# Altium project ai_uwb_smart_flashlight.PrjPcb (part 6 of 6)
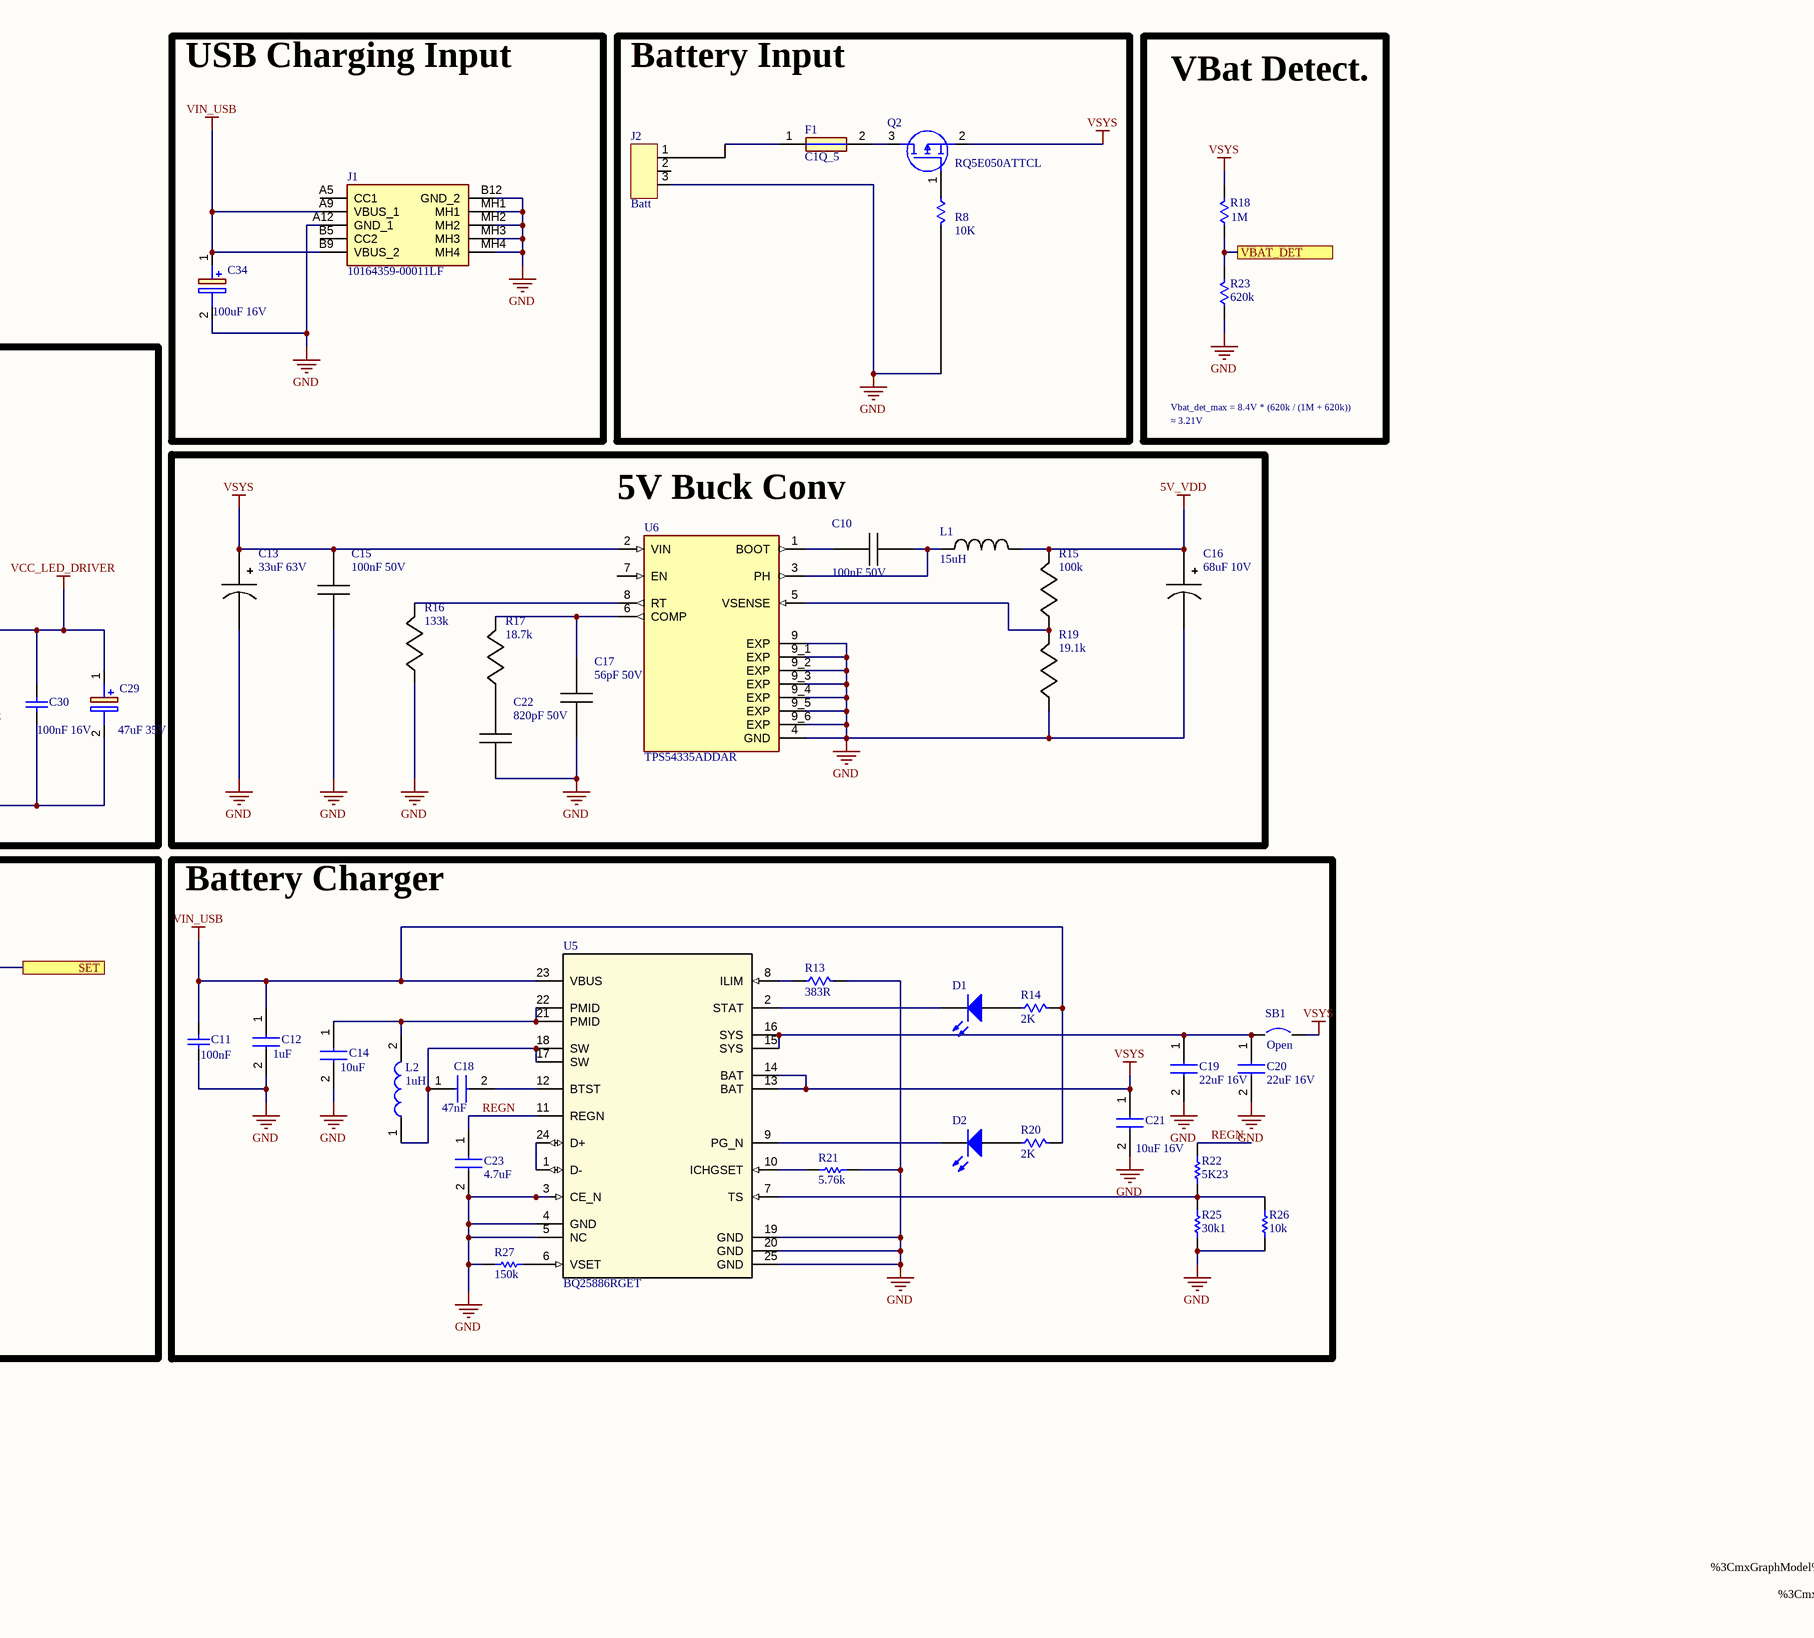
[diagram p8: Power supply.SchDoc, right]

## Sheet Power supply.SchDoc (continued)

### Library data of the parts
C10 C15 = C0805C104M5RACTU: Cap: 1.0E-7; ESR: 0.064; IRMS: 1.64; VDC: 50.0; Vendor: Kemet; Type: DEV; REFDES_2: RefDes; TYPE_2: TYPE; VALUE_2: Value; Manufacturer Part Number: C0805C104M5RACTU; Manufacturer_Name: Kemet; Copyright: Copyright (C) 2018 Accelerated Designs. All rights reserved; RefDes: RefDes; Value: Value
C11 C26 C28 C30 = CC0603KRX7R7BB104: CAP CER 0.1UF 16V X7R 0603; Manufacturer: Yageo; Tolerance: 10%; Material: Ceramic; Insulation Resistance: 100GR; ComponentLink1Description: https://datasheet.ciiva.com/11786/0900766b80d84f1d-11786077.pdf?src-supplier=RSComponents; ComponentLink1URL: https://datasheet.ciiva.com/11786/0900766b80d84f1d-11786077.pdf?src-supplier=RSComponents; Supplier 1: Digi-Key; Manufacturer Part Number: CC0603KRX7R7BB104; RoHS: Yes; Category: Ceramic Capacitors; Stock 1: 17560067; Pricing 1: 1=0,10000, 10=0,04800, 50=0,02600, 100=0,02120, 500=0,01516, 1000=0,01192 (USD); Mount: Surface Mount; Case/Package: 0603; Number of Pins: 2; Case Code (Metric): 1608; Case Code (Imperial): 0603; Min Operating Temperature: -55°C; Max Operating Temperature: 125°C; Capacitance: 100nF; Voltage Rating: 16V; Voltage Rating (DC): 16V; Packaging: Tape and Reel; Package Quantity: 1; Dielectric: X7R; Termination: SMD/SMT; Resistor Type: Ceramic; Voltage: 16V; Series: CC; Length: 1.6mm; Width: 0.031inch; Height: 0.8mm; Thickness: 0.035inch; Depth: 0.8mm; Radiation Hardening: No; REACH SVHC: No SVHC; Lead Free: Lead Free; Halogen Free: Halogen Free; RoHS Compliant: Yes; ComponentLink2URL: https://datasheet.ciiva.com/8033/70765-8033799.pdf?src-supplier=Element14; ComponentLink2Description: https://datasheet.ciiva.com/8033/70765-8033799.pdf?src-supplier=Element14; ComponentLink3URL: https://datasheet.ciiva.com/7978/1489800-7978141.pdf?src-supplier=Element14; ComponentLink3Description: https://datasheet.ciiva.com/7978/1489800-7978141.pdf?src-supplier=Element14; ComponentLink4URL: https://datasheet.ciiva.com/28450/1489800-28450552.pdf?src-supplier=Element14; ComponentLink4Description: https://datasheet.ciiva.com/28450/1489800-28450552.pdf?src-supplier=Element14; ComponentLink5URL: https://datasheet.ciiva.com/46430/1734573-46430156.pdf?src-supplier=Element14; ComponentLink5Description: https://datasheet.ciiva.com/46430/1734573-46430156.pdf?src-supplier=Element14; ComponentLink6URL: https://datasheet.ciiva.com/144/mlccorderingcode-144183.pdf?src-supplier=Digi-Key; ComponentLink6Description: https://datasheet.ciiva.com/144/mlccorderingcode-144183.pdf?src-supplier=Digi-Key; ComponentLink7URL: https://datasheet.ciiva.com/144/mlccorderingcode-144182.pdf?src-supplier=Digi-Key; ComponentLink7Description: https://datasheet.ciiva.com/144/mlccorderingcode-144182.pdf?src-supplier=Digi-Key; Supplier Part Number 1: 311-1088-1-ND; Arrow Part Number: CC0603KRX7R7BB104; Mouser Part Number: 603-CC603KRX7R7BB104; ComponentLink8URL: https://datasheet.ciiva.com/144/mlccorderingcode-144184.pdf?src-supplier=Digi-Key; ComponentLink8Description: https://datasheet.ciiva.com/144/mlccorderingcode-144184.pdf?src-supplier=Digi-Key; ComponentLink9URL: https://datasheet.ciiva.com/8033/1734573-8033797.pdf?src-supplier=Element14; ComponentLink9Description: https://datasheet.ciiva.com/8033/1734573-8033797.pdf?src-supplier=Element14; ComponentLink10URL: https://datasheet.ciiva.com/13395/upy-gphc-x7r-6-3v-to-50v-8-13395674.pdf?src-supplier=Mouser; ComponentLink10Description: https://datasheet.ciiva.com/13395/upy-gphc-x7r-6-3v-to-50v-8-13395674.pdf?src-supplier=Mouser
C12 = CL21B105KOFNNNE: CAP CER 1UF 16V X7R 0805; Manufacturer 1: Samsung; Tolerance: 10%; Height: 1.25mm; Mouser Part Number: 187-CL21B105KOFNNNE; Arrow Part Number: CL21B105KOFNNNE; Supplier 1: Digi-Key; RoHS: Yes; Category: Ceramic Capacitors; Stock 1: 1019337; Pricing 1: 1=0,10000, 10=0,05600, 50=0,03060, 100=0,02500, 500=0,01782, 1000=0,01401 (USD); Mount: Surface Mount; Case/Package: 0805; Case Code (Metric): 2012; Case Code (Imperial): 0805; Contact Plating: Tin; Min Operating Temperature: -55°C; Max Operating Temperature: 125°C; Package Quantity: 1; Packaging: Tape and Reel; Capacitance: 1uF; Voltage Rating: 16V; Dielectric: X7R; Voltage Rating (DC): 16V; Voltage: 16V; Series: CL; Construction: Flat; Length: 2mm; Width: 0.049inch; Thickness: 0.053inch; Depth: 1.25mm; Radiation Hardening: No; Lead Free: Lead Free; RoHS Compliant: Yes; ComponentLink1URL: https://datasheet.ciiva.com/25800/cl21b105kofnnne-25800257.pdf?src-supplier=Digi-Key; ComponentLink1Description: https://datasheet.ciiva.com/25800/cl21b105kofnnne-25800257.pdf?src-supplier=Digi-Key; ComponentLink2URL: https://datasheet.ciiva.com/26838/getdatasheetpartid-358361-26838673.pdf?src-supplier=Verical; ComponentLink2Description: https://datasheet.ciiva.com/26838/getdatasheetpartid-358361-26838673.pdf?src-supplier=Verical; ComponentLink3URL: https://datasheet.ciiva.com/26310/mlcc-catalogdownload2013-eng-26310166.pdf?src-supplier=Distrelec; ComponentLink3Description: https://datasheet.ciiva.com/26310/mlcc-catalogdownload2013-eng-26310166.pdf?src-supplier=Distrelec; Supplier Part Number 1: 1276-1026-1-ND; Manufacturer Part Number: CL21B105KOFNNNE
C13 = EEHZA1J330P: No Description Available; Cap: 3.3E-5; ESR: 0.04; IRMS: 1.7; VDC: 63.0; Vendor: Panasonic; Type: DEV; Datasheet_URL: http://industrial.panasonic.com/www%2Ddata/pdf/ABA0000/ABA0000CE136.pdf; Manufacturer Part Number: EEHZA1J330P; Manufacturer_Name: Panasonic; Copyright: Copyright (C) 2018 Accelerated Designs. All rights reserved; RefDes: RefDes; Value: Value
C14 C19-C21 C27 = CL21B105KOFNNNE: Manufacturer 1: Samsung; Manufacturer Part Number: CL10X106MO8NRNC; ComponentLink1URL: https://datasheet.ciiva.com/25800/cl21b105kofnnne-25800257.pdf?src-supplier=Digi-Key; ComponentLink1Description: https://datasheet.ciiva.com/25800/cl21b105kofnnne-25800257.pdf?src-supplier=Digi-Key; ComponentLink2URL: https://datasheet.ciiva.com/26838/getdatasheetpartid-358361-26838673.pdf?src-supplier=Verical; ComponentLink2Description: https://datasheet.ciiva.com/26838/getdatasheetpartid-358361-26838673.pdf?src-supplier=Verical; ComponentLink3URL: https://datasheet.ciiva.com/26310/mlcc-catalogdownload2013-eng-26310166.pdf?src-supplier=Distrelec; ComponentLink3Description: https://datasheet.ciiva.com/26310/mlcc-catalogdownload2013-eng-26310166.pdf?src-supplier=Distrelec; Supplier Part Number 1: 1276-6769-1-ND; Supplier 1: Digikey
  C19 C20: Supplier Part Number 1: 1276-6780-1-ND
C16 = 10SVPC68M: 10SVPC68M 68uF 10V; Cap: 6.8E-5; ESR: 0.03; IRMS: 1.97; VDC: 10.0; Vendor: Panasonic; Type: DEV; Datasheet_URL: https://industrial.panasonic.com/content/data/CP/PDF/OS%2DCON/S%5FOS%2DCON%5FSVPC%5Fe.pdf; Manufacturer Part Number: 10SVPC68M; Manufacturer_Name: Panasonic; Copyright: Copyright (C) 2018 Accelerated Designs. All rights reserved; RefDes: RefDes; Value: Value
C17 = CC0805JRNPO9BN56: Manufacturer Part Number: CC0805JRNPO9BN560; Manufacturer_Name: Yageo; Cap: 5.6E-11; ESR: 0.0; VDC: 50.0; Vendor: Yageo America; Type: DEV; REFDES_2: RefDes; TYPE_2: TYPE; VALUE_2: Value; Datasheet_URL: http://www.yageo.com/documents/recent/UPY%2DGP%5FNP0%5F16V%2Dto%2D50V%5F10.pdf; IRMS: 0.0; Copyright: Copyright (C) 2018 Accelerated Designs. All rights reserved; RefDes: RefDes; Value: Value
C18 = CL21B105KOFNNNE: Manufacturer 1: Samsung; Manufacturer Part Number: KGM21NR71C473KT; ComponentLink1URL: https://datasheet.ciiva.com/25800/cl21b105kofnnne-25800257.pdf?src-supplier=Digi-Key; ComponentLink1Description: https://datasheet.ciiva.com/25800/cl21b105kofnnne-25800257.pdf?src-supplier=Digi-Key; ComponentLink2URL: https://datasheet.ciiva.com/26838/getdatasheetpartid-358361-26838673.pdf?src-supplier=Verical; ComponentLink2Description: https://datasheet.ciiva.com/26838/getdatasheetpartid-358361-26838673.pdf?src-supplier=Verical; ComponentLink3URL: https://datasheet.ciiva.com/26310/mlcc-catalogdownload2013-eng-26310166.pdf?src-supplier=Distrelec; ComponentLink3Description: https://datasheet.ciiva.com/26310/mlcc-catalogdownload2013-eng-26310166.pdf?src-supplier=Distrelec; Supplier Part Number 1: KGM21NR71C473KT; Supplier 1: Avnet
C22 = CL05C821JB5NNNC: Cap: 8.2E-10; ESR: 0.0; VDC: 50.0; Vendor: Samsung Electro-Mechanics; Type: DEV; REFDES_2: RefDes; TYPE_2: TYPE; VALUE_2: Value; Datasheet_URL: http://www.samsungsem.com/servlet/FileDownload?type%3Dspec%26file%3DCL05C821JB5NNNC.pdf; IRMS: 0.0; Manufacturer Part Number: CL05C821JB5NNNC; Manufacturer_Name: Samsung Electro-Mechanics; Copyright: Copyright (C) 2018 Accelerated Designs. All rights reserved; RefDes: RefDes; Value: Value
C23 = CL21B105KOFNNNE: Manufacturer 1: Samsung; Manufacturer Part Number: C0805C475M3PAC; ComponentLink1URL: https://datasheet.ciiva.com/25800/cl21b105kofnnne-25800257.pdf?src-supplier=Digi-Key; ComponentLink1Description: https://datasheet.ciiva.com/25800/cl21b105kofnnne-25800257.pdf?src-supplier=Digi-Key; ComponentLink2URL: https://datasheet.ciiva.com/26838/getdatasheetpartid-358361-26838673.pdf?src-supplier=Verical; ComponentLink2Description: https://datasheet.ciiva.com/26838/getdatasheetpartid-358361-26838673.pdf?src-supplier=Verical; ComponentLink3URL: https://datasheet.ciiva.com/26310/mlcc-catalogdownload2013-eng-26310166.pdf?src-supplier=Distrelec; ComponentLink3Description: https://datasheet.ciiva.com/26310/mlcc-catalogdownload2013-eng-26310166.pdf?src-supplier=Distrelec; Supplier Part Number 1: 1276-1026-1-ND; Supplier 1: Arrow Electronics; Supplier Part Number 1: C0805C475M3PACTU
C24 = CL21B105KOFNNNE: Manufacturer Part Number: GRM21BR61E106KA3L; ComponentLink1URL: https://datasheet.ciiva.com/25800/cl21b105kofnnne-25800257.pdf?src-supplier=Digi-Key; ComponentLink1Description: https://datasheet.ciiva.com/25800/cl21b105kofnnne-25800257.pdf?src-supplier=Digi-Key; ComponentLink2URL: https://datasheet.ciiva.com/26838/getdatasheetpartid-358361-26838673.pdf?src-supplier=Verical; ComponentLink2Description: https://datasheet.ciiva.com/26838/getdatasheetpartid-358361-26838673.pdf?src-supplier=Verical; ComponentLink3URL: https://datasheet.ciiva.com/26310/mlcc-catalogdownload2013-eng-26310166.pdf?src-supplier=Distrelec; ComponentLink3Description: https://datasheet.ciiva.com/26310/mlcc-catalogdownload2013-eng-26310166.pdf?src-supplier=Distrelec; Supplier 1: Mouser
C25 = CL21B105KOFNNNE: Manufacturer 1: Samsung; ComponentLink1URL: https://datasheet.ciiva.com/25800/cl21b105kofnnne-25800257.pdf?src-supplier=Digi-Key; ComponentLink1Description: https://datasheet.ciiva.com/25800/cl21b105kofnnne-25800257.pdf?src-supplier=Digi-Key; ComponentLink2URL: https://datasheet.ciiva.com/26838/getdatasheetpartid-358361-26838673.pdf?src-supplier=Verical; ComponentLink2Description: https://datasheet.ciiva.com/26838/getdatasheetpartid-358361-26838673.pdf?src-supplier=Verical; ComponentLink3URL: https://datasheet.ciiva.com/26310/mlcc-catalogdownload2013-eng-26310166.pdf?src-supplier=Distrelec; ComponentLink3Description: https://datasheet.ciiva.com/26310/mlcc-catalogdownload2013-eng-26310166.pdf?src-supplier=Distrelec; Manufacturer Part Number: CL21B105KOFNNNE; Supplier Part Number 1: 81-GRM188R71A225KE15; Supplier 1: Digikey; Supplier Part Number 1: 490-4520-1-ND
C29 = 865080543009: Capacitor Polarised; Manufacturer_Name: Wurth Elektronik; Datasheet Link: https://katalog.we-online.de/pbs/datasheet/865080543009.pdf; Height: 5.5mm; Manufacturer Part Number: 865080543009; Mouser Part Number: 710-865080543009; Mouser Price/Stock: https://www.mouser.co.uk/ProductDetail/Wurth-Elektronik/865080543009?qs=0KOYDY2FL2%2F%252BYmhMLtEhDQ%3D%3D
C31 = CL21B105KOFNNNE: CAP CER 100pF 16V; Manufacturer Part Number: CC603JRNPO9BN101; ComponentLink1URL: https://datasheet.ciiva.com/25800/cl21b105kofnnne-25800257.pdf?src-supplier=Digi-Key; ComponentLink1Description: https://datasheet.ciiva.com/25800/cl21b105kofnnne-25800257.pdf?src-supplier=Digi-Key; ComponentLink2URL: https://datasheet.ciiva.com/26838/getdatasheetpartid-358361-26838673.pdf?src-supplier=Verical; ComponentLink2Description: https://datasheet.ciiva.com/26838/getdatasheetpartid-358361-26838673.pdf?src-supplier=Verical; ComponentLink3URL: https://datasheet.ciiva.com/26310/mlcc-catalogdownload2013-eng-26310166.pdf?src-supplier=Distrelec; ComponentLink3Description: https://datasheet.ciiva.com/26310/mlcc-catalogdownload2013-eng-26310166.pdf?src-supplier=Distrelec; Supplier 1: Mouser
C32 = CL21B105KOFNNNE: 39nF CAP 0603; Manufacturer Part Number: 06035C393KAT2A; ComponentLink1URL: https://datasheet.ciiva.com/25800/cl21b105kofnnne-25800257.pdf?src-supplier=Digi-Key; ComponentLink1Description: https://datasheet.ciiva.com/25800/cl21b105kofnnne-25800257.pdf?src-supplier=Digi-Key; ComponentLink2URL: https://datasheet.ciiva.com/26838/getdatasheetpartid-358361-26838673.pdf?src-supplier=Verical; ComponentLink2Description: https://datasheet.ciiva.com/26838/getdatasheetpartid-358361-26838673.pdf?src-supplier=Verical; ComponentLink3URL: https://datasheet.ciiva.com/26310/mlcc-catalogdownload2013-eng-26310166.pdf?src-supplier=Distrelec; ComponentLink3Description: https://datasheet.ciiva.com/26310/mlcc-catalogdownload2013-eng-26310166.pdf?src-supplier=Distrelec; Supplier 1: Rs
C34 = 865230345005: Capacitor Polarised; Manufacturer_Name: Wurth Elektronik; Datasheet Link: https://katalog.we-online.com/pbs/datasheet/865230345005.pdf; Height: 7.7mm; Manufacturer Part Number: 865230345005; Mouser Part Number: 710-865230345005; Mouser Price/Stock: https://www.mouser.co.uk/ProductDetail/Wurth-Elektronik/865230345005?qs=0KOYDY2FL28Zlg1oW7uKxw%3D%3D
D1 D2 = LED3: Typical BLUE SiC LED; Manufacturer Part Number: LTST-C191TBKT; Published: 8-Jun-2000; LatestRevisionDate: 17-Dec-2003; LatestRevisionNote: PCB Footprint replaced.; DatasheetVersion: 16-Apr-2002; PackageVersion: 16-Apr-2002; PackageReference: 3.5X2.8X1.9; Publisher: Altium Limited; PackageDescription: SM LED; 2 C-Bend Leads; Body 3.5 x 2.8 x 1.9 mm, inc leads (LxWxH typ)
  D1: Supplier 1: Digikey; Supplier Part Number 1: 160-1647-1-ND
D4 = CDBC560-G: Schottky Diode; Manufacturer_Name: Comchip Technology; Datasheet Link: http://www.comchiptech.com/admin/files/product/CDBC520-HF%20Thru195217.%20CDBC5100-HF%20RevB.pdf; Height: 2.62mm; Manufacturer Part Number: CDBC560-G; Mouser Part Number: 750-CDBC560-G; Mouser Price/Stock: https://www.mouser.co.uk/ProductDetail/Comchip-Technology/CDBC560-G?qs=tw%252BuQ%2FB6PO18CUb5Ok%252Bysw%3D%3D; Arrow Part Number: CDBC560-G; Arrow Price/Stock: https://www.arrow.com/en/products/cdbc560-g/comchip-technology?region=nac
D6 = LED3
F1 = C1Q_5: FUSE BOARD MOUNT 5A 125VAC 63VDC; Manufacturer: Bel; Manufacturer Part Number: C1Q5; Voltage Rating (DC): 63V; Voltage Rating (AC): 125V; DC Cold Resistance: 21mR; Power Dissipation: 960mW; Fuse Type: Board Mount (Cartridge Style Excluded); Approvals: CSA,cULus,CE; Height: 0.023inch; Mouser Part Number: 530-C1Q5; Arrow Part Number: C1Q 5; Supplier 1: Digi-Key; RoHS: Yes; Category: Fuses; Stock 1: 308418; Pricing 1: 1=0,29000, 5=0,27800, 10=0,26600, 50=0,23720, 100=0,22090, 250=0,19636, 500=0,16362, 1000=0,15544 (USD); Mount: Surface Mount; Case/Package: 1206; Number of Pins: 2; Case Code (Metric): 3216; Case Code (Imperial): 1206; Contact Plating: Tin; Housing Material: Ceramic; Min Operating Temperature: -55°C; Max Operating Temperature: 125°C; Current Rating: 5A; Packaging: Tape and Reel; Max Voltage Rating (DC): 63V; Voltage Rating: 125V; Series: C1Q; Length: 3.07mm; Width: 0.062inch; Depth: 1.52mm; Lead Free: Lead Free; RoHS Compliant: Yes; ComponentLink1URL: https://datasheet.ciiva.com/300/c1q-300587.pdf?src-supplier=Digi-Key; ComponentLink1Description: https://datasheet.ciiva.com/300/c1q-300587.pdf?src-supplier=Digi-Key; ComponentLink2URL: https://datasheet.ciiva.com/300/c1q-300588.pdf?src-supplier=Digi-Key; ComponentLink2Description: https://datasheet.ciiva.com/300/c1q-300588.pdf?src-supplier=Digi-Key; ComponentLink3URL: https://datasheet.ciiva.com/300/c1q-300589.pdf?src-supplier=Digi-Key; ComponentLink3Description: https://datasheet.ciiva.com/300/c1q-300589.pdf?src-supplier=Digi-Key; ComponentLink4URL: https://datasheet.ciiva.com/8264/c1q-8264014.pdf?src-supplier=Avnet; ComponentLink4Description: https://datasheet.ciiva.com/8264/c1q-8264014.pdf?src-supplier=Avnet; Supplier Part Number 1: 507-1085-1-ND
J1 = 10164359-00011LF: Connector; Manufacturer_Name: Amphenol; Datasheet Link: https://cdn.amphenol-cs.com/media/wysiwyg/files/drawing/10164359.pdf; Height: 3.41mm; Manufacturer Part Number: 10164359-00011LF; Mouser Part Number: 649-10164359-00011LF; Mouser Price/Stock: https://www.mouser.co.uk/ProductDetail/Amphenol-FCI/10164359-00011LF?qs=MyNHzdoqoQLpQ%2FmSqA1%252BtQ%3D%3D; Arrow Part Number: 10164359-00011LF; Arrow Price/Stock: https://www.arrow.com/en/products/10164359-00011lf/amphenol-fci?region=nac
JP1 JP2 = Circuit Breaker_close: Conn / 42375-1855 / + / jumper / 60900213621; PN: 42375-1855 and 60900213621; Published: 24-Mar-1999; Publisher: Altium Limited
JP6 JP7 = Circuit Breaker_close: Jumper / 42375-1855; Published: 24-Mar-1999; PN: 42375-1855; Publisher: Altium Limited
L1 = SRR1280-150M: No Description Available; L: 1.5E-5; DCR: 0.0285; IDC: 5.0; Vendor: Bourns; Type: DEV; Manufacturer Part Number: SRR1280-150M; Manufacturer_Name: Bourns; Copyright: Copyright (C) 2018 Accelerated Designs. All rights reserved; RefDes: RefDes; Value: Value
L2 = VLS5045EX-1R0N: Inductor; Manufacturer_Name: TDK; Datasheet Link: https://product.tdk.com/system/files/dam/doc/product/inductor/inductor/smd/catalog/inductor_commercial_power_vls5045ex_en.pdf; Height: 4mm; Manufacturer Part Number: VLS5045EX-1R0N; Mouser Part Number: 810-VLS5045EX-1R0N; Mouser Price/Stock: https://www.mouser.co.uk/ProductDetail/TDK/VLS5045EX-1R0N?qs=oF%2FSscNnLpB3ZWKi2BLUdQ%3D%3D; Arrow Part Number: VLS5045EX-1R0N; Arrow Price/Stock: https://www.arrow.com/en/products/vls5045ex-1r0n/tdk?region=nac
L3 = PA2240.332NLT: Inductor; Manufacturer_Name: Pulse Electronics; Datasheet Link: https://ro.mouser.com/datasheet/2/447/P863-2902843.pdf; Height: 7mm; Manufacturer Part Number: PA2240.332NLT; Mouser Part Number: 673-PA2240.332NLT; Mouser Price/Stock: https://www.mouser.co.uk/ProductDetail/Pulse-Electronics/PA2240332NLT?qs=82jvyl5dHWfVJrUGjRlM3A%3D%3D; Arrow Part Number: PA2240.332NLT; Arrow Price/Stock: https://www.arrow.com/en/products/pa2240.332nlt/pulse-electronics-corporation
L4 = HCMA1707-470-R: Inductor; Manufacturer_Name: Eaton; Datasheet Link: https://componentsearchengine.com/Datasheets/1/HCMA1707-470-R.pdf; Height: 7mm; Manufacturer Part Number: HCMA1707-470-R; Mouser Part Number: 704-HCMA1707-470-R; Mouser Price/Stock: https://www.mouser.co.uk/ProductDetail/Coiltronics-Eaton/HCMA1707-470-R?qs=9V2QonpqdTuFAlLvwt84GQ%3D%3D
Q2 = RQ5E050ATTCL: MOSFET P-CH 30V 5A TSMT3; Manufacturer: Rohm; Mouser Part Number: 755-RQ5E050ATTCL; Supplier 1: Digi-Key; Manufacturer Part Number: RQ5E050ATTCL; RoHS: Yes; Category: MOSFETs; Stock 1: 25; Pricing 1: 1=0,63000, 10=0,55200, 100=0,42300, 500=0,33440, 1000=0,26752 (USD); Supplier Part Number 1: RQ5E050ATTCLCT-ND
R8 = RC0603FR-0710KL: RES SMD 10K OHM 1% 1/10W 0603; Manufacturer 1: Yageo; Voltage Rating: 75V; Resistance: 10kR; Power Rating: 100mW; Temperature Coefficient: 100ppm/°C; Voltage Rating (DC): 50V; Supplier 1: Digi-Key; RoHS: Yes; Stock 1: 45404531; Pricing 1: 1=0,10000, 10=0,02300, 100=0,00940, 1000=0,00421, 2500=0,00366 (USD); Case/Package: 0603; Number of Pins: 2; Case Code (Imperial): 0603; Case Code (Metric): 1608; Weight: 7.1E-05oz; Min Operating Temperature: -55°C; Max Operating Temperature: 155°C; Packaging: Tape and Reel; Tolerance: 1%; Termination: SMD/SMT; Length: 1.6mm; Width: 0.8mm; Height: 0.45mm; Depth: 0.8mm; Lead Pitch: 0.3mm; REACH SVHC: No SVHC; Military Standard: Not; Lead Free: Lead Free; Supplier Part Number 1: 311-10.0KHRCT-ND; Manufacturer Part Number: RC0603FR-0710KL; Composition: Thick Film; ComponentLink1URL: https://datasheet.ciiva.com/7660/38590-7660789.pdf?src-supplier=Element14; ComponentLink1Description: https://datasheet.ciiva.com/7660/38590-7660789.pdf?src-supplier=Element14; ComponentLink2URL: https://datasheet.ciiva.com/22747/443971-22747519.pdf?src-supplier=Element14; ComponentLink2Description: https://datasheet.ciiva.com/22747/443971-22747519.pdf?src-supplier=Element14; ComponentLink3URL: https://datasheet.ciiva.com/15189/getdatasheetpartid-409289-15189591.pdf?src-supplier=Verical; ComponentLink3Description: https://datasheet.ciiva.com/15189/getdatasheetpartid-409289-15189591.pdf?src-supplier=Verical; ComponentLink4URL: https://datasheet.ciiva.com/46440/1868787-46440891.pdf?src-supplier=Element14; ComponentLink4Description: https://datasheet.ciiva.com/46440/1868787-46440891.pdf?src-supplier=Element14; ComponentLink5URL: https://datasheet.ciiva.com/7983/443971-7983596.pdf?src-supplier=Element14; ComponentLink5Description: https://datasheet.ciiva.com/7983/443971-7983596.pdf?src-supplier=Element14; ComponentLink6URL: https://datasheet.ciiva.com/7746/1738695-7746239.pdf?src-supplier=Element14; ComponentLink6Description: https://datasheet.ciiva.com/7746/1738695-7746239.pdf?src-supplier=Element14; Arrow Part Number: RC0603FR-0710KL
R13 = RC0603FR-072KL: Manufacturer Part Number: ERJ-3EKF3830V; Tolerance: ±1%; Temperature Coefficient: ±100ppm/°C; Power (Watts): 0.1W, 1/10W; Supplier 1: Digi-Key; RoHS: ERJ-3EKF3830V; Category: Resistors; Stock 1: 3425058; Pricing 1: 1=0.1, 10=0.015, 100=0.006, 1000=0.00268, 2500=0.00233 (USD); Packaging: Cut Tape (CT); Features: Moisture Resistant; ComponentLink1URL: http://www.yageo.com/documents/recent/PYu-RC_Group_51_RoHS_L_8.pdf; ComponentLink1Description: http://www.yageo.com/documents/recent/PYu-RC_Group_51_RoHS_L_8.pdf; Supplier Part Number 1: 311-2.00KHRCT-ND; Part Status: Active; Composition: Thick Film; Operating Temperature: -55°C ~ 155°C; Package / Case: 0603 (1608 Metric); Supplier Device Package: 0603; Size / Dimension: 0.063" L x 0.032" W (1.60mm x 0.80mm); Height - Seated (Max): 0.022" (0.55mm); Failure Rate: -; Mouser Part Number: 603-RC0603FR-072KL; Arrow Part Number: RC0603FR-072KL
R14 R20 = RC0603FR-072KL: RES SMD 2K OHM 1% 1/10W 0603; Manufacturer: Yageo; Temperature Coefficient: ±100ppm/°C; Power (Watts): 0.1W, 1/10W; Supplier 1: Digi-Key; Manufacturer Part Number: RC0603FR-072KL; RoHS: RoHS Compliant; Category: Resistors; Stock 1: 3425058; Pricing 1: 1=0.1, 10=0.015, 100=0.006, 1000=0.00268, 2500=0.00233 (USD); Tolerance: ±1%; Packaging: Cut Tape (CT); Features: Moisture Resistant; ComponentLink1URL: http://www.yageo.com/documents/recent/PYu-RC_Group_51_RoHS_L_8.pdf; ComponentLink1Description: http://www.yageo.com/documents/recent/PYu-RC_Group_51_RoHS_L_8.pdf; Supplier Part Number 1: 311-2.00KHRCT-ND; Part Status: Active; Composition: Thick Film; Operating Temperature: -55°C ~ 155°C; Package / Case: 0603 (1608 Metric); Supplier Device Package: 0603; Size / Dimension: 0.063" L x 0.032" W (1.60mm x 0.80mm); Height - Seated (Max): 0.022" (0.55mm); Failure Rate: -; Mouser Part Number: 603-RC0603FR-072KL; Arrow Part Number: RC0603FR-072KL
R15 = CRCW0402100KFKED: 100k Resistor; Resistance: 100000.0; Power: 0.063; Tolerance: 1.0; Vendor: Vishay-Dale; Manufacturer Part Number: CRCW0402100KFKED; Manufacturer_Name: Vishay-Dale; Copyright: Copyright (C) 2018 Accelerated Designs. All rights reserved; RefDes: RefDes; Type: DEV; Value: Value
R16 = RC0201FR-07133KL: Manufacturer_Name: Yageo; Resistance: 133000.0; Power: 0.05; Tolerance: 1.0; Vendor: Yageo America; Datasheet_URL: http://www.yageo.com/documents/recent/PYu%2DRC%5FGroup%5F51%5FRoHS%5FL%5F5.pdf; Manufacturer Part Number: RC0201FR-07133KL; Copyright: Copyright (C) 2018 Accelerated Designs. All rights reserved; RefDes: RefDes; Type: DEV; Value: Value
R17 = RC0201FR-0718K7L: Manufacturer_Name: Yageo; Resistance: 18700.0; Power: 0.05; Tolerance: 1.0; Vendor: Yageo America; Datasheet_URL: http://www.yageo.com/documents/recent/PYu%2DRC%5FGroup%5F51%5FRoHS%5FL%5F5.pdf; Manufacturer Part Number: RC0201FR-0718K7L; Copyright: Copyright (C) 2018 Accelerated Designs. All rights reserved; RefDes: RefDes; Type: DEV; Value: Value
R18 = RC0603FR-071ML: RES SMD 1M OHM 1% 1/10W 0603; Manufacturer 1: Yageo; Voltage Rating: 50V; Resistance: 1MR; Power Rating: 100mW; Temperature Coefficient: 100ppm/°C; Supplier 1: Digi-Key; Manufacturer Part Number: RC0603FR-071ML; RoHS: Yes; Category: Chip SMD Resistors; Stock 1: 2192141; Pricing 1: 1=0,10000, 10=0,02300, 100=0,00940, 1000=0,00421, 2500=0,00366 (USD); Case/Package: 0603; Number of Pins: 2; Case Code (Imperial): 0603; Case Code (Metric): 1608; Min Operating Temperature: -55°C; Max Operating Temperature: 155°C; Voltage Rating (DC): 50V; Tolerance: 1%; Packaging: Tape and Reel; Package Quantity: 5000; Termination: SMD/SMT; Composition: Thick Film; Military Standard: Not; Length: 1.6mm; Height: 0.45mm; Width: 0.8mm; Depth: 0.8mm; REACH SVHC: No SVHC; Lead Free: Lead Free; ComponentLink1URL: https://datasheet.ciiva.com/11819/0900766b80f96399-11819295.pdf?src-supplier=RSComponents; ComponentLink1Description: https://datasheet.ciiva.com/11819/0900766b80f96399-11819295.pdf?src-supplier=RSComponents; ComponentLink2URL: https://datasheet.ciiva.com/7983/443971-7983614.pdf?src-supplier=Element14; ComponentLink2Description: https://datasheet.ciiva.com/7983/443971-7983614.pdf?src-supplier=Element14; ComponentLink3URL: https://datasheet.ciiva.com/12555/rc0603-272842-12555388.pdf?src-supplier=Mouser; ComponentLink3Description: https://datasheet.ciiva.com/12555/rc0603-272842-12555388.pdf?src-supplier=Mouser; Supplier Part Number 1: 311-1.00MHRCT-ND
R19 = CRCW040219K1FKED: Resistance: 19100.0; Power: 0.063; Tolerance: 1.0; Vendor: Vishay-Dale; Manufacturer Part Number: CRCW040219K1FKED; Manufacturer_Name: Vishay-Dale; Copyright: Copyright (C) 2018 Accelerated Designs. All rights reserved; RefDes: RefDes; Type: DEV; Value: Value
R21 = RES_DNP: Resistor DNP 0603 5.76k; Manufacturer Part Number: RC0603FR-075K76L; Supplier 1: Mouser
R22 = RES_DNP: Resistor DNP 0603; Manufacturer Part Number: ERJ-3EKF5231V; Supplier 1: Mouser; Supplier Part Number 1: 667-ERJ-3EKF5231V
R23 = RC0603FR-071ML: RES SMD 620k OHM 1% 1/10W 0603; Manufacturer 1: Vishay; Manufacturer Part Number: CRCW0603620KFKEA; Voltage Rating: 50V; Power Rating: 100mW; Temperature Coefficient: 100ppm/°C; RoHS: Yes; Category: Chip SMD Resistors; Stock 1: 118 792; Pricing 1: 1=0,10000, 10=0,02300, 100=0,00940, 1000=0,00421, 2500=0,00366 (USD); Case/Package: 0603; Number of Pins: 2; Case Code (Imperial): 0603; Case Code (Metric): 1608; Min Operating Temperature: -55°C; Max Operating Temperature: 155°C; Voltage Rating (DC): 50V; Resistance: 620k; Tolerance: 1%; Packaging: Tape and Reel; Package Quantity: 5000; Termination: SMD/SMT; Composition: Thick Film; Military Standard: Not; Length: 1.6mm; Height: 0.45mm; Width: 0.8mm; Depth: 0.8mm; REACH SVHC: No SVHC; Lead Free: Lead Free; ComponentLink1URL: https://datasheet.ciiva.com/11819/0900766b80f96399-11819295.pdf?src-supplier=RSComponents; ComponentLink1Description: https://datasheet.ciiva.com/11819/0900766b80f96399-11819295.pdf?src-supplier=RSComponents; ComponentLink2URL: https://datasheet.ciiva.com/7983/443971-7983614.pdf?src-supplier=Element14; ComponentLink2Description: https://datasheet.ciiva.com/7983/443971-7983614.pdf?src-supplier=Element14; ComponentLink3URL: https://datasheet.ciiva.com/12555/rc0603-272842-12555388.pdf?src-supplier=Mouser; ComponentLink3Description: https://datasheet.ciiva.com/12555/rc0603-272842-12555388.pdf?src-supplier=Mouser; Supplier 1: Mouser; Supplier Part Number 1: 71-CRCW0603-620K-E3
R25 = RES_DNP: Resistor DNP 0603; Manufacturer Part Number: CRCW0603-30.1K-E3; Supplier 1: Mouser
R26 = RES_DNP: Resistor DNP 0603; Manufacturer Part Number: CRCW0603-10K-E3; Supplier 1: Mouser
R27 = RES_DNP: Resistor DNP 0603; Manufacturer Part Number: RT0603BRE07250RL; Supplier 1: Mouser; Supplier Part Number 1: 603-RT0603BRE07250RL
R28 = RES_DNP: Resistor DNP 0603 158k; Manufacturer Part Number: CRCW0603-158K-E3; Supplier 1: Mouser
R29 = RC0603FR-07100KL: RES SMD 100K OHM 1% 1/10W 0603; Manufacturer: Yageo; Resistance: 100kR; Power Rating: 100mW; Voltage Rating: 50V; Temperature Coefficient: 100ppm/°C; Working Voltage: 75V; Supplier 1: Digi-Key; Manufacturer Part Number: RC0603FR-07100KL; RoHS: Yes; Category: Chip SMD Resistors; Stock 1: 18088280; Pricing 1: 1=0,10000, 10=0,02400, 100=0,00970, 1000=0,00436, 2500=0,00378 (USD); Case/Package: 0603; Number of Pins: 2; Case Code (Imperial): 0603; Case Code (Metric): 1608; Min Operating Temperature: -55°C; Max Operating Temperature: 155°C; Tolerance: 1%; Packaging: Tape and Reel; Termination: SMD/SMT; Resistor Type: Thick Film; Number of Terminations: 2; Features: Moisture Resistant; Series: RC; Max Power Dissipation: 100mW; Resistance Tolerance: 1%; Construction: Rectangular; Voltage Rating (DC): 50V; Technology: THICK FILM; Length: 1.6mm; Width: 0.8mm; Height: 0.45mm; Depth: 0.8mm; REACH SVHC: No SVHC; Military Standard: Not; Lead Free: Lead Free; RoHS Compliant: Yes; ComponentLink1URL: https://datasheet.ciiva.com/11808/0900766b80f96399-11808107.pdf?src-supplier=RSComponents; ComponentLink1Description: https://datasheet.ciiva.com/11808/0900766b80f96399-11808107.pdf?src-supplier=RSComponents; ComponentLink2URL: https://datasheet.ciiva.com/7983/443971-7983593.pdf?src-supplier=Element14; ComponentLink2Description: https://datasheet.ciiva.com/7983/443971-7983593.pdf?src-supplier=Element14; ComponentLink3URL: https://datasheet.ciiva.com/22747/443971-22747516.pdf?src-supplier=Element14; ComponentLink3Description: https://datasheet.ciiva.com/22747/443971-22747516.pdf?src-supplier=Element14; ComponentLink4URL: https://datasheet.ciiva.com/46440/1868787-46440889.pdf?src-supplier=Element14; ComponentLink4Description: https://datasheet.ciiva.com/46440/1868787-46440889.pdf?src-supplier=Element14; ComponentLink5URL: https://datasheet.ciiva.com/7746/1738695-7746235.pdf?src-supplier=Element14; ComponentLink5Description: https://datasheet.ciiva.com/7746/1738695-7746235.pdf?src-supplier=Element14; ComponentLink6URL: https://datasheet.ciiva.com/7746/1738695-7746234.pdf?src-supplier=Element14; ComponentLink6Description: https://datasheet.ciiva.com/7746/1738695-7746234.pdf?src-supplier=Element14; Supplier Part Number 1: 311-100KHRCT-ND; Arrow Part Number: RC0603FR-07100KL; Mouser Part Number: 603-RC0603FR-07100KL
R30 = RES_DNP: Resistor DNP 0603; Manufacturer Part Number: CRCW0603-931K-E3; Supplier 1: Mouser
R31 = RES_DNP: Resistor DNP 0603; Manufacturer Part Number: CRCW0603-44.2K-E3; Supplier 1: Mouser
R32 = RES_DNP: Resistor DNP 0603; Manufacturer Part Number: CRCW0603-48.7K-E3; Supplier 1: Mouser; Supplier Part Number 1: 71-CRCW0603-48.7K-E3; Supplier 2: Mouser
R33 = RES_DNP: Resistor DNP 0603 150mOhm RL0603FR-070R15L; Supplier 1: Mouser; Manufacturer Part Number: RL0603FR-070R15L
R34 = RES_DNP: Resistor DNP 0603 ERJ-3BWFR056V 56mOhm; Supplier 1: Mouser; Manufacturer Part Number: ERJ-3BWFR056V
SB1 = Circuit Breaker_close: Circuit Breaker; Published: 24-Mar-1999; Revision: July-2002: Re-released for DXP Platform.; Publisher: Altium Limited
U4 = TPS61288LRQQR_1: 18-V, 15-A synchronous boost converter; MF: Texas Instruments; Package: VFQFN-11 Texas Instruments; Price: None; Check_prices: https://www.snapeda.com/parts/TPS61288LRQQR/Texas+Instruments/view-part/?ref=eda; Value: *; SnapEDA_Link: https://www.snapeda.com/parts/TPS61288LRQQR/Texas+Instruments/view-part/?ref=snap; Manufacturer Part Number: TPS61288LRQQR; Availability: In Stock; Purchase-URL: https://pricing.snapeda.com/search?q=TPS61288LRQQR&ref=eda; Supplier 1: Mouser; Supplier Part Number 1: 595-TPS61288LRQQR
U5 = BQ25886RGET: No Description Available; Mfr_Name: Texas Instruments; TYPE: TYPE; RefDes: RefDes; Supplier 1: Mouser; Supplier Part Number 1: 595-BQ25886RGET; Manufacturer Part Number: BQ25886RGET
U6 = TPS54335ADDAR: 4.5V to 28V Input, 3A, Synchronous, Step-Down Converter with Eco-mode; M: Texas Instruments; SnapEDA_Link: https://www.snapeda.com/parts/TPS54335ADDAR/Texas+Instruments/view-part/?ref=snap; Package: HSOIC-8 Texas Instruments; Manufacturer Part Number: TPS54335ADDAR; Check_prices: https://www.snapeda.com/parts/TPS54335ADDAR/Texas+Instruments/view-part/?ref=eda; Supplier 1: Mouser; Supplier Part Number 1: 595-TPS54335ADDAR
U7 = AL8843SP-13: Integrated Circuit; Manufacturer_Name: Diodes Incorporated; Datasheet Link: https://www.diodes.com//assets/Datasheets/AL8843.pdf; Height: 1.63mm; Manufacturer Part Number: AL8843SP-13; Mouser Part Number: 621-AL8843SP-13; Mouser Price/Stock: https://www.mouser.co.uk/ProductDetail/Diodes-Incorporated/AL8843SP-13?qs=W0yvOO0ixfGIfc2b%252B8ZHVA%3D%3D; Arrow Part Number: AL8843SP-13; Arrow Price/Stock: https://www.arrow.com/en/products/al8843sp-13/diodes-incorporated?region=nac

## Nets that join several sheets
5V_VDD: MCU and Peripherals (5 pins), Power supply (C16.1 L1.2 R15.1)
GND: MCU and Peripherals (27 pins), Power supply (58 pins)
NetJ3_13: MCU and Peripherals (J3.13 J6.3), Power supply (JP7.1 U4.6)
NetJ5_5: MCU and Peripherals (J5.5), Power supply (JP6.2)
NetJ5_12: MCU and Peripherals (J5.12), Power supply (R18.1 R23.2)

## Assembly variants
LicheeRV: all parts fitted
Variant of ai_uwb_smart_flashlight: all parts fitted
Cubie: all parts fitted